# Altium schematic sheet Memory.SchDoc
size A4
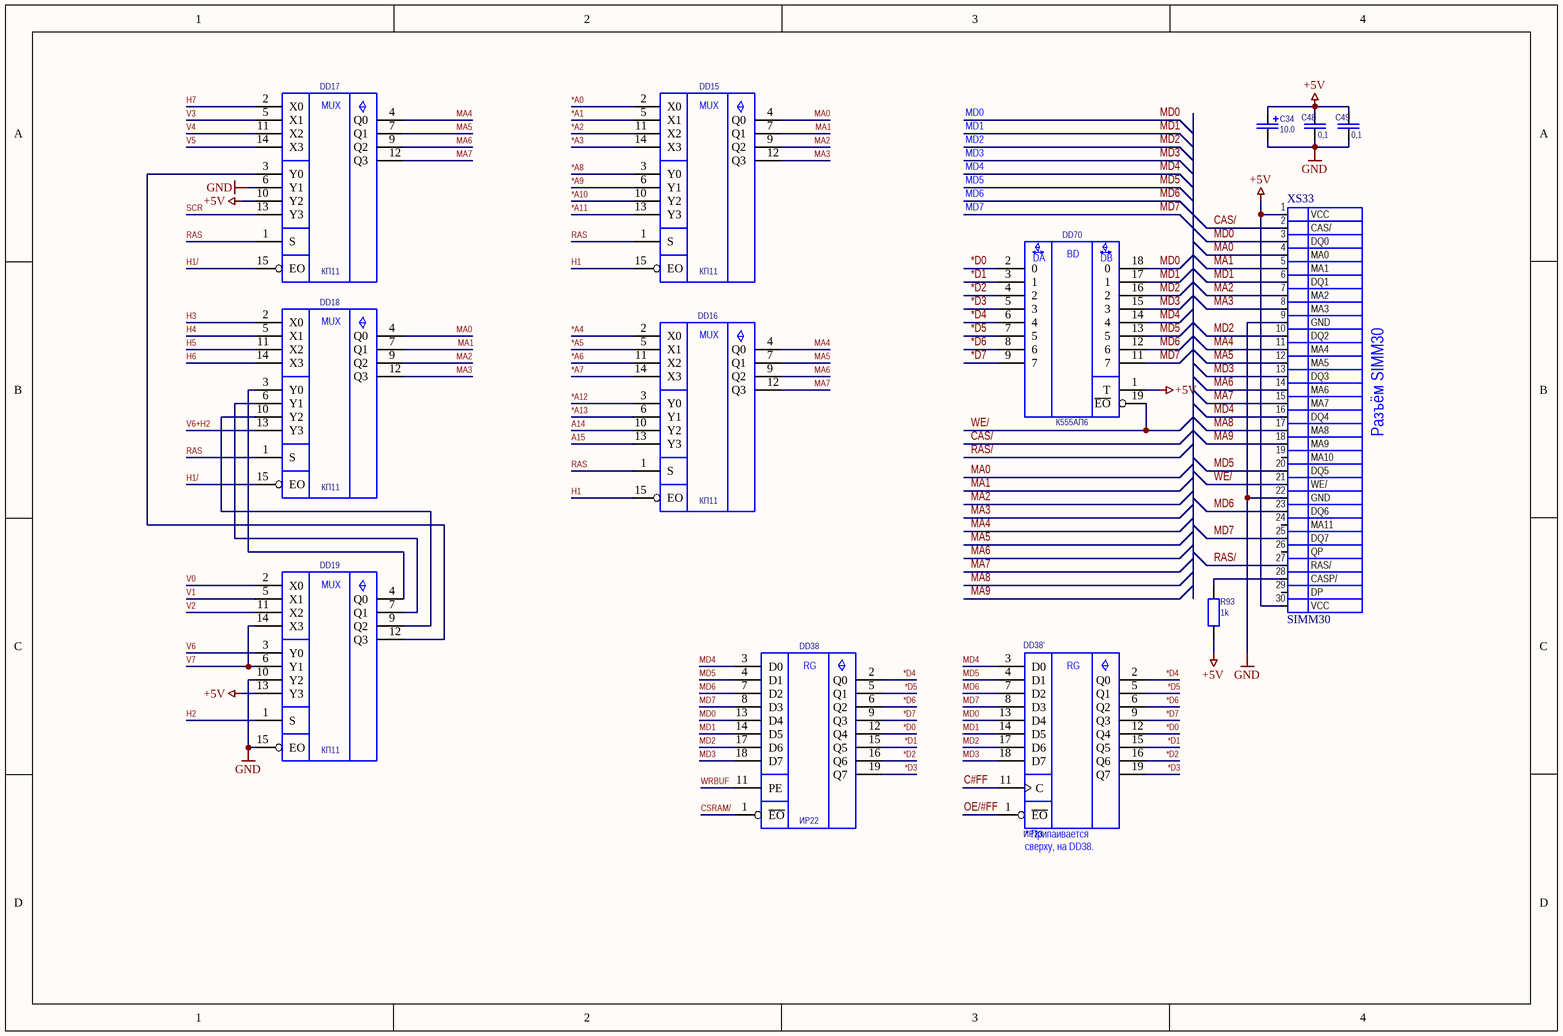
[diagram p0: Memory.SchDoc]

## Parts
C34  value 10.0  [AL CAP P=2.5 D=3]  (hidden comment: CP)
C48  value 0,1  [CAP]
C49  value 0,1  [CAP]
DD15  Type: КП11  [DIP16]
DD16  Type: КП11  [DIP16]
DD17  Type: КП11  [DIP16]
DD18  Type: КП11  [DIP16]
DD19  Type: КП11  [DIP16]
DD38  Type: ИР22  [DIP20]
DD38'  Type: ИР23  [DIP20]  (hidden comment: К555ИР23)
DD70  (no value)  [DIP20]
R93  value 1k  [RES]
XS33  SIMM30  [SIMM30]

## Nets
+5V: C34.1 C48.1 C49.1 DD15.16(+5V) DD16.16(+5V) DD17.10(Y2) DD17.16(+5V) DD18.16(+5V) DD19.13(Y3) DD19.16(+5V) DD38.20(+5V) DD38'.20(+5V) DD70.1(T) DD70.20(+5V) R93.2 XS33.1(VCC) XS33.30(VCC)
GND: C34.2 C48.2 C49.2 DD15.8(GND) DD16.8(GND) DD17.6(Y1) DD17.8(GND) DD18.8(GND) DD19.8(GND) DD19.10(Y2) DD19.15(EO) DD38.10(GND) DD38'.10(GND) DD70.10(GND) XS33.9(GND) XS33.22(GND)
*A0: DD15.2(X0)
*A1: DD15.5(X1)
*A2: DD15.11(X2)
*A3: DD15.14(X3)
*A4: DD16.2(X0)
*A5: DD16.5(X1)
*A6: DD16.11(X2)
*A7: DD16.14(X3)
*A8: DD15.3(Y0)
*A9: DD15.6(Y1)
*A10: DD15.10(Y2)
*A11: DD15.13(Y3)
*A12: DD16.3(Y0)
*A13: DD16.6(Y1)
*D0: DD38.12(Q4) DD38'.12(Q4) DD70.2(0)
*D1: DD38.15(Q5) DD38'.15(Q5) DD70.3(1)
*D2: DD38.16(Q6) DD38'.16(Q6) DD70.4(2)
*D3: DD38.19(Q7) DD38'.19(Q7) DD70.5(3)
*D4: DD38.2(Q0) DD38'.2(Q0) DD70.6(4)
*D5: DD38.5(Q1) DD38'.5(Q1) DD70.7(5)
*D6: DD38.6(Q2) DD38'.6(Q2) DD70.8(6)
*D7: DD38.9(Q3) DD38'.9(Q3) DD70.9(7)
A14: DD16.10(Y2)
A15: DD16.13(Y3)
C#FF: DD38'.11(C)
CAS/: XS33.2(CAS/)
CSRAM/: DD38.1(~{EO})
H1: DD15.15(EO) DD16.15(EO)
H1/: DD17.15(EO) DD18.15(EO)
H2: DD19.1(S)
H3: DD18.2(X0)
H4: DD18.5(X1)
H5: DD18.11(X2)
H6: DD18.14(X3)
H7: DD17.2(X0)
MA0: DD15.4(Q0) DD18.4(Q0) XS33.4(MA0)
MA1: DD15.7(Q1) DD18.7(Q1) XS33.5(MA1)
MA2: DD15.9(Q2) DD18.9(Q2) XS33.7(MA2)
MA3: DD15.12(Q3) DD18.12(Q3) XS33.8(MA3)
MA4: DD16.4(Q0) DD17.4(Q0) XS33.11(MA4)
MA5: DD16.7(Q1) DD17.7(Q1) XS33.12(MA5)
MA6: DD16.9(Q2) DD17.9(Q2) XS33.14(MA6)
MA7: DD16.12(Q3) DD17.12(Q3) XS33.15(MA7)
MA8: XS33.17(MA8)
MA9: XS33.18(MA9)
MD0: DD38.13(D4) DD38'.13(D4) DD70.18(0) XS33.3(DQ0)
MD1: DD38.14(D5) DD38'.14(D5) DD70.17(1) XS33.6(DQ1)
MD2: DD38.17(D6) DD38'.17(D6) DD70.16(2) XS33.10(DQ2)
MD3: DD38.18(D7) DD38'.18(D7) DD70.15(3) XS33.13(DQ3)
MD4: DD38.3(D0) DD38'.3(D0) DD70.14(4) XS33.16(DQ4)
MD5: DD38.4(D1) DD38'.4(D1) DD70.13(5) XS33.20(DQ5)
MD6: DD38.7(D2) DD38'.7(D2) DD70.12(6) XS33.23(DQ6)
MD7: DD38.8(D3) DD38'.8(D3) DD70.11(7) XS33.25(DQ7)
OE/#FF: DD38'.1(~{EO})
RAS: DD15.1(S) DD16.1(S) DD17.1(S) DD18.1(S)
RAS/: XS33.27(RAS/)
SCR: DD17.13(Y3)
V0: DD19.2(X0)
V1: DD19.5(X1)
V2: DD19.11(X2)
V3: DD17.5(X1)
V4: DD17.11(X2)
V5: DD17.14(X3)
V6: DD19.3(Y0)
V6+H2: DD18.13(Y3)
V7: DD19.6(Y1) DD19.14(X3)
WE/: DD70.19(~{EO}) XS33.21(WE/)
WRBUF: DD38.11(PE)
NetDD17_3: DD17.3(Y0) DD19.12(Q3)
NetDD18_3: DD18.3(Y0) DD19.4(Q0)
NetDD18_6: DD18.6(Y1) DD19.7(Q1)
NetDD18_10: DD18.10(Y2) DD19.9(Q2)
NetR93_1: R93.1 XS33.28(CASP/)

Not connected (* = marked no-connect by the designer): XS33 19(MA10) 24(MA11) 26(QP) 29(DP)

## Notes on the sheet
- MD0
- MD1
- MD2
- MD3
- MD4
- MD5
- MD6
- MD7
- Разъём SIMM30
- (near DD38') сверху, на DD38.
- (near DD38') * Припаивается
- (in symbol К555АП6) BD; DA; DB
- (in symbol К555ИР22) RG
- (in symbol К555ИР23) RG
- (in symbol К555КП11) MUX

## Library data of the parts
C48 C49 = C: Type: C
DD15-DD19 = К555КП11
DD38 = К555ИР22
DD70 = К555АП6: Type: К555АП6
R93 = RES: Type: RES
C34 = CP: Type: CP